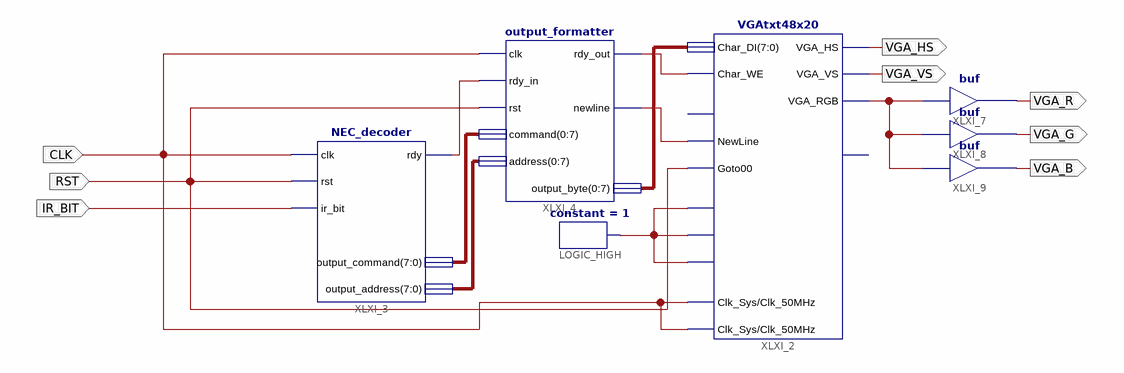
[diagram p0: schematic sheet 1]
// Xilinx ISE schematic print_address_and_command.sch (spartan3e) as structural Verilog: 7 symbols, 8 ports
module print_address_and_command (
  input  IR_BIT,
  input  CLK,
  input  RST,
  output VGA_HS,
  output VGA_VS,
  output VGA_R,
  output VGA_G,
  output VGA_B
);

  wire LOGIC_ONE, XLXN_19, XLXN_64, XLXN_65, XLXN_77;
  wire [7:0] XLXN_24, XLXN_25, XLXN_66;

  VGAtxt48x20 XLXI_2 (
    .Char_DI({XLXN_66[0], XLXN_66[1], XLXN_66[2], XLXN_66[3], XLXN_66[4], XLXN_66[5], XLXN_66[6], XLXN_66[7]}),
    .NewLine(XLXN_65), .Goto00(RST), .Clk_Sys(CLK), .Clk_50MHz(CLK), .CursorOn(LOGIC_ONE),
    .ScrollEn(LOGIC_ONE), .ScrollClear(LOGIC_ONE), .VGA_HS(VGA_HS), .VGA_VS(VGA_VS), .VGA_RGB(XLXN_77),
    .Char_WE(XLXN_64));  // open: Home, Busy
  NEC_decoder XLXI_3 (
    .clk(CLK), .rst(RST), .ir_bit(IR_BIT), .rdy(XLXN_19), .output_command(XLXN_24), .output_address(XLXN_25));
  output_formatter XLXI_4 (
    .clk(CLK), .rdy_in(XLXN_19), .rst(RST), .command(XLXN_24), .address(XLXN_25), .rdy_out(XLXN_64),
    .newline(XLXN_65),
    .output_byte({XLXN_66[0], XLXN_66[1], XLXN_66[2], XLXN_66[3], XLXN_66[4], XLXN_66[5], XLXN_66[6], XLXN_66[7]}));
  constant #(.CValue("1")) LOGIC_HIGH (.O(LOGIC_ONE));
  buf XLXI_7 (VGA_R, XLXN_77);
  buf XLXI_8 (VGA_G, XLXN_77);
  buf XLXI_9 (VGA_B, XLXN_77);
endmodule
